# Altium schematic sheet RHD2164 USBC.SchDoc: RHD2164_headstage_BGA
size B; SheetTotal: 1; Origin: Eagle; Date: 2023-03-02 9:30:12 PM; SheetNumber: 1; GateName_1: G$1; SymbolName_1: LETTER_L; LibraryName: frames; DeviceSetName: LETTER_L; GateName_2: G$2; SymbolName_2: DOCFIELD; Sheet: Sheet:; REV: REV:
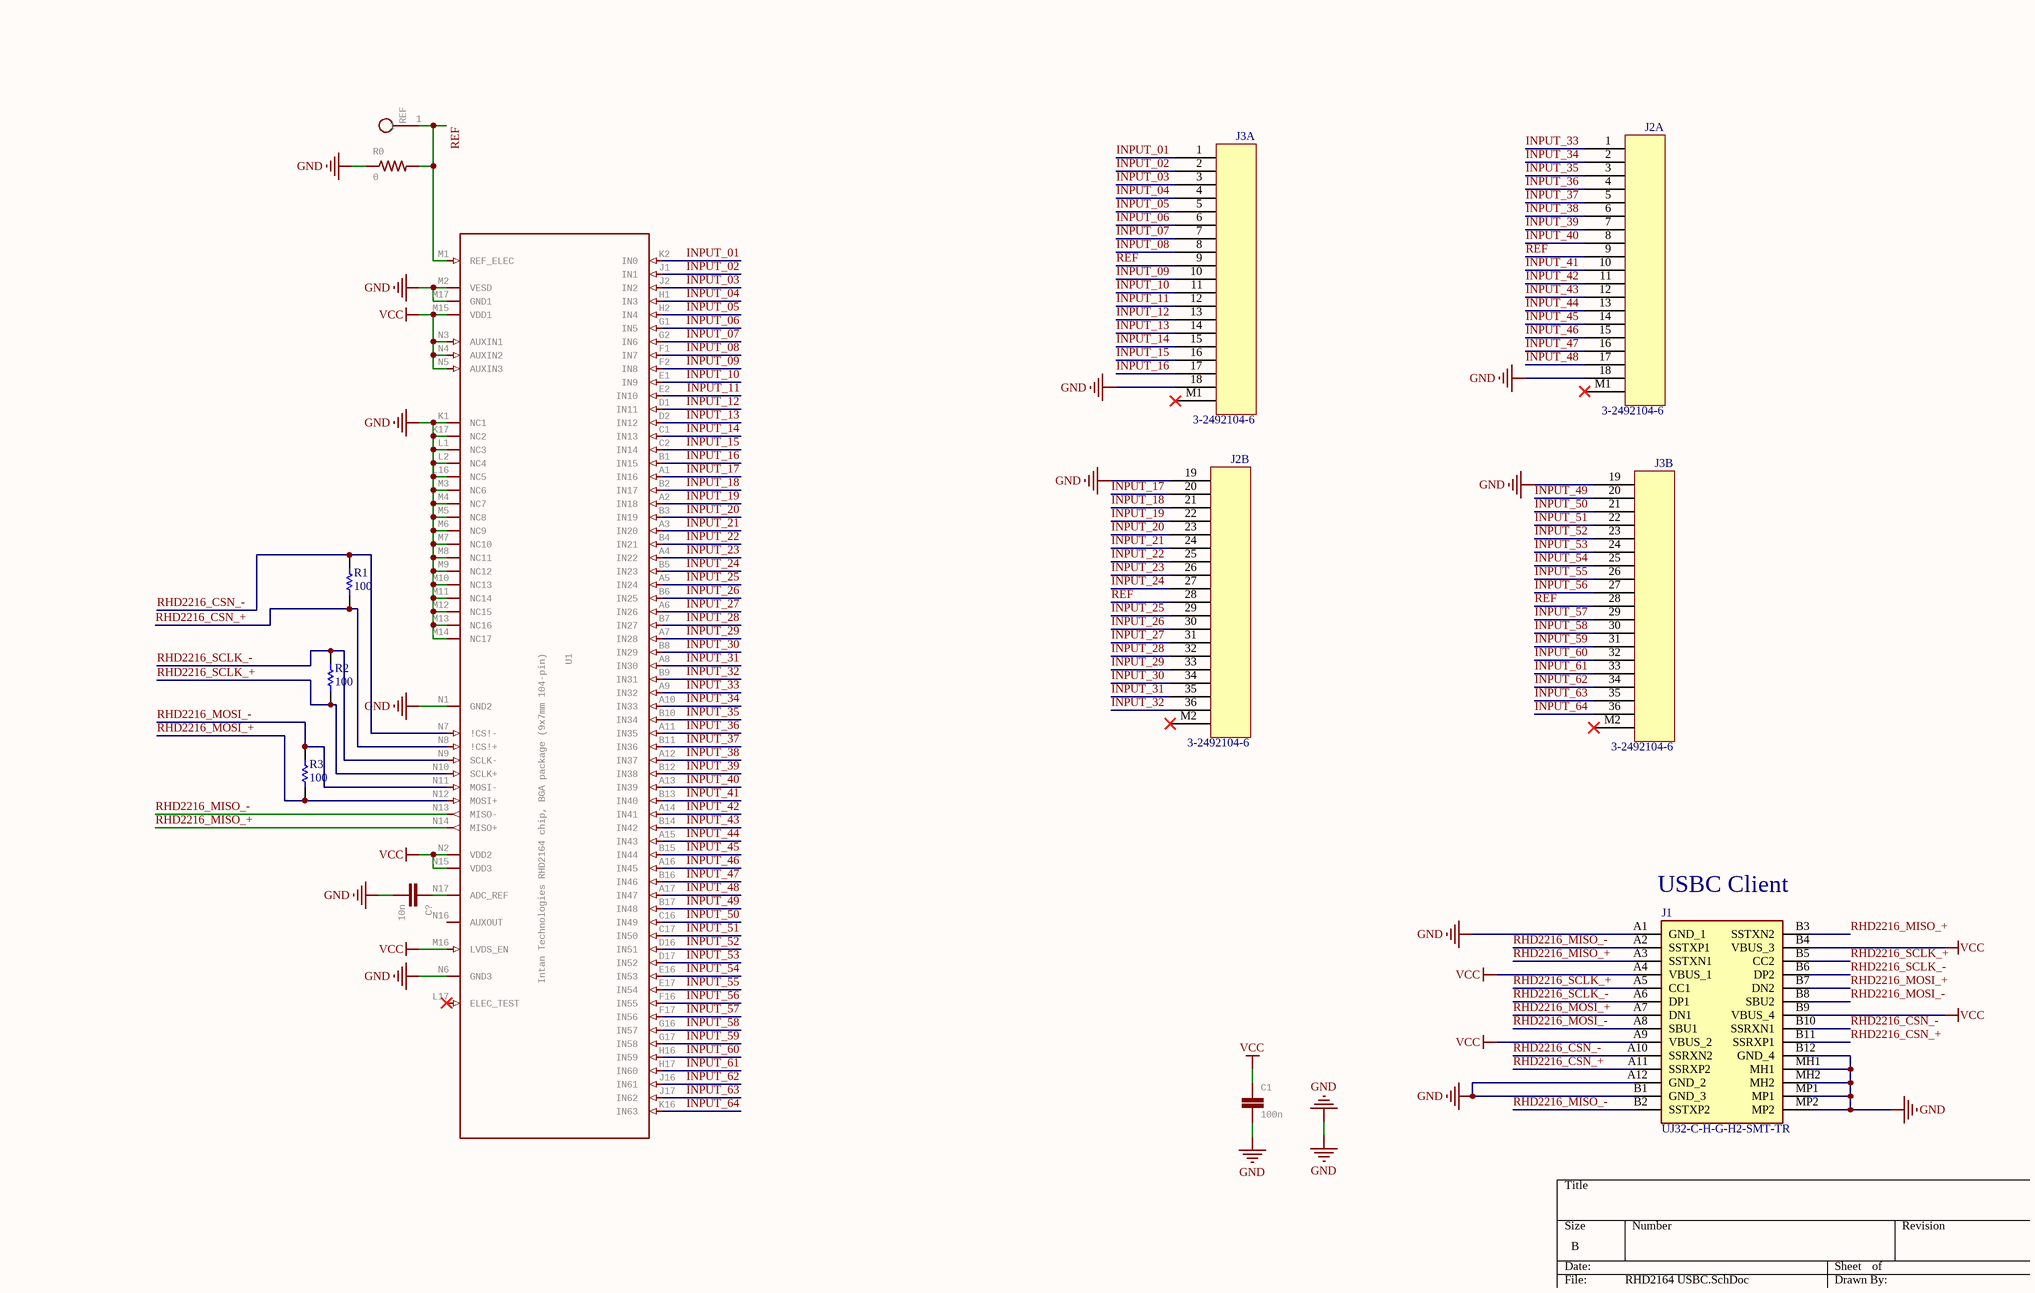
[diagram p0: RHD2164 USBC.SchDoc]

## Parts
C1  100n  [0402]
C?  10n  [0402]
J1  UJ32-C-H-G-H2-SMT-TR  [UJ32CHGH2SMTTR]
J2  3-2492104-6  [CON_ZIF_RA_36POS]  (parts A,B of 2)
J3  3-2492104-6  [CON_ZIF_RA_36POS]  (parts A,B of 2)
R0  0  [0402]
R1  value 100  [0402]  (hidden comment: Res Semi)
R2  value 100  [0402]  (hidden comment: Res Semi)
R3  value 100  [0402]  (hidden comment: Res Semi)
REF  TESTPOINT_SMALL  [TESTPOINT_SMALL]  (value not drawn)
U1  Intan Technologies RHD2164 chip, BGA package (9x7mm 104-pin)  [BGA104_9X7]

## Nets
GND: C1.2 C?.2 J1.A1(GND_1) J1.A12(GND_2) J1.B1(GND_3) J1.B12(GND_4) J1.MH1 J1.MH2 J1.MP1 J1.MP2 J2.18 J2.19 J3.18 J3.19 R0.1 U1.K1(NC1) U1.K17(NC2) U1.L1(NC3) U1.L2(NC4) U1.L16(NC5) U1.M2(VESD) U1.M3(NC6) U1.M4(NC7) U1.M5(NC8) U1.M6(NC9) U1.M7(NC10) U1.M8(NC11) U1.M9(NC12) U1.M10(NC13) U1.M11(NC14) U1.M12(NC15) U1.M13(NC16) U1.M14(NC17) U1.M17(GND1) U1.N1(GND2) U1.N6(GND3)
VCC: C1.1 J1.A4(VBUS_1) J1.A9(VBUS_2) J1.B4(VBUS_3) J1.B9(VBUS_4) U1.M15(VDD1) U1.M16(LVDS_EN) U1.N2(VDD2) U1.N3(AUXIN1) U1.N4(AUXIN2) U1.N5(AUXIN3) U1.N15(VDD3)
INPUT_01: J3.1 U1.K2(IN0)
INPUT_02: J3.2 U1.J1(IN1)
INPUT_03: J3.3 U1.J2(IN2)
INPUT_04: J3.4 U1.H1(IN3)
INPUT_05: J3.5 U1.H2(IN4)
INPUT_06: J3.6 U1.G1(IN5)
INPUT_07: J3.7 U1.G2(IN6)
INPUT_08: J3.8 U1.F1(IN7)
INPUT_09: J3.10 U1.F2(IN8)
INPUT_10: J3.11 U1.E1(IN9)
INPUT_11: J3.12 U1.E2(IN10)
INPUT_12: J3.13 U1.D1(IN11)
INPUT_13: J3.14 U1.D2(IN12)
INPUT_14: J3.15 U1.C1(IN13)
INPUT_15: J3.16 U1.C2(IN14)
INPUT_16: J3.17 U1.B1(IN15)
INPUT_17: J2.20 U1.A1(IN16)
INPUT_18: J2.21 U1.B2(IN17)
INPUT_19: J2.22 U1.A2(IN18)
INPUT_20: J2.23 U1.B3(IN19)
INPUT_21: J2.24 U1.A3(IN20)
INPUT_22: J2.25 U1.B4(IN21)
INPUT_23: J2.26 U1.A4(IN22)
INPUT_24: J2.27 U1.B5(IN23)
INPUT_25: J2.29 U1.A5(IN24)
INPUT_26: J2.30 U1.B6(IN25)
INPUT_27: J2.31 U1.A6(IN26)
INPUT_28: J2.32 U1.B7(IN27)
INPUT_29: J2.33 U1.A7(IN28)
INPUT_30: J2.34 U1.B8(IN29)
INPUT_31: J2.35 U1.A8(IN30)
INPUT_32: J2.36 U1.B9(IN31)
INPUT_33: J2.1 U1.A9(IN32)
INPUT_34: J2.2 U1.A10(IN33)
INPUT_35: J2.3 U1.B10(IN34)
INPUT_36: J2.4 U1.A11(IN35)
INPUT_37: J2.5 U1.B11(IN36)
INPUT_38: J2.6 U1.A12(IN37)
INPUT_39: J2.7 U1.B12(IN38)
INPUT_40: J2.8 U1.A13(IN39)
INPUT_41: J2.10 U1.B13(IN40)
INPUT_42: J2.11 U1.A14(IN41)
INPUT_43: J2.12 U1.B14(IN42)
INPUT_44: J2.13 U1.A15(IN43)
INPUT_45: J2.14 U1.B15(IN44)
INPUT_46: J2.15 U1.A16(IN45)
INPUT_47: J2.16 U1.B16(IN46)
INPUT_48: J2.17 U1.A17(IN47)
INPUT_49: J3.20 U1.B17(IN48)
INPUT_50: J3.21 U1.C16(IN49)
INPUT_51: J3.22 U1.C17(IN50)
INPUT_52: J3.23 U1.D16(IN51)
INPUT_53: J3.24 U1.D17(IN52)
INPUT_54: J3.25 U1.E16(IN53)
INPUT_55: J3.26 U1.E17(IN54)
INPUT_56: J3.27 U1.F16(IN55)
INPUT_57: J3.29 U1.F17(IN56)
INPUT_58: J3.30 U1.G16(IN57)
INPUT_59: J3.31 U1.G17(IN58)
INPUT_60: J3.32 U1.H16(IN59)
INPUT_61: J3.33 U1.H17(IN60)
INPUT_62: J3.34 U1.J16(IN61)
INPUT_63: J3.35 U1.J17(IN62)
INPUT_64: J3.36 U1.K16(IN63)
REF: J2.9 J2.28 J3.9 J3.28 R0.2 REF.1 U1.M1(REF_ELEC)
RHD2216_CSN_+: J1.A11(SSRXP2) J1.B11(SSRXP1) R1.2 U1.N8(!CS!+)
RHD2216_CSN_-: J1.A10(SSRXN2) J1.B10(SSRXN1) R1.1 U1.N7(!CS!-)
RHD2216_MISO_+: J1.A3(SSTXN1) J1.B3(SSTXN2) U1.N14(MISO+)
RHD2216_MISO_-: J1.A2(SSTXP1) J1.B2(SSTXP2) U1.N13(MISO-)
RHD2216_MOSI_+: J1.A7(DN1) J1.B7(DN2) R3.2 U1.N12(MOSI+)
RHD2216_MOSI_-: J1.A8(SBU1) J1.B8(SBU2) R3.1 U1.N11(MOSI-)
RHD2216_SCLK_+: J1.A5(CC1) J1.B5(CC2) R2.2 U1.N10(SCLK+)
RHD2216_SCLK_-: J1.A6(DP1) J1.B6(DP2) R2.1 U1.N9(SCLK-)
NetC?_1: C?.1 U1.N17(ADC_REF)

Not connected (* = marked no-connect by the designer): J2 M1* M2*; J3 M1* M2*; U1 L17(ELEC_TEST)* N16(AUXOUT)

## Notes on the sheet
- (near J1) USBC Client

## Library data of the parts
C1 C? = C_0402: Capacitor; GateName_1: C; DeviceName: _0402; SymbolName_1: C; LibraryName: RHD2000_eval_board; DeviceSetName: C
J1 = UJ32-C-H-G-H2-SMT-TR: USB Connectors Type C USB 3.2 Gen 2x2 20 Gbps 20 Vac 5 A Horizontal Gold Flash Surface Mount; Manufacturer_Name: Same Sky; Geometry.Height: 3.62mm; Mouser Part Number: 179-UJ32CHGH2SMTTR; Mouser Price/Stock: https://www.mouser.co.uk/ProductDetail/CUI-Devices/UJ32-C-H-G-H2-SMT-TR?qs=vvQtp7zwQdN9hqweK3Xukg%3D%3D; Manufacturer_Part_Number: UJ32-C-H-G-H2-SMT-TR; Datasheet Link: https://www.cuidevices.com/product/resource/uj32-c-h-g-h2-smt-tr.pdf
J2 J3 = CON_ZIF_RA_36POS: 36 Position FPC Connector Contacts, Bottom 0.020" (0.50mm) Surface Mount, Right Angle; GRAMS Lib Spec: 2.7
R0 = R_0402: Resistor; GateName_1: R; DeviceName: _0402; SymbolName_1: R; LibraryName: RHD2000_eval_board; DeviceSetName: R
R1-R3 = Res Semi: Semiconductor Resistor; Published: 8-Jun-2000; LatestRevisionDate: 17-Jul-2002; LatestRevisionNote: Re-released for DXP Platform.; PackageReference: AXIAL-0.5; Publisher: Altium Limited; PackageDescription: Axial Device, Thru-Hole; 2 Leads; 0.5 in Pin Spacing
REF = TESTPOINT_SMALL: PCB Test Point; GateName_1: TP$1; DeviceName: _SMALL; SymbolName_1: TESTPOINT; LibraryName: RHD2000_eval_board; DeviceSetName: TESTPOINT
U1 = RHD2164_BGA_BGA: GateName_1: A; DeviceName: _BGA; SymbolName_1: RHD2164_BGA; LibraryName: RHD2000; DeviceSetName: RHD2164_BGA; Package: BGA104_9X7